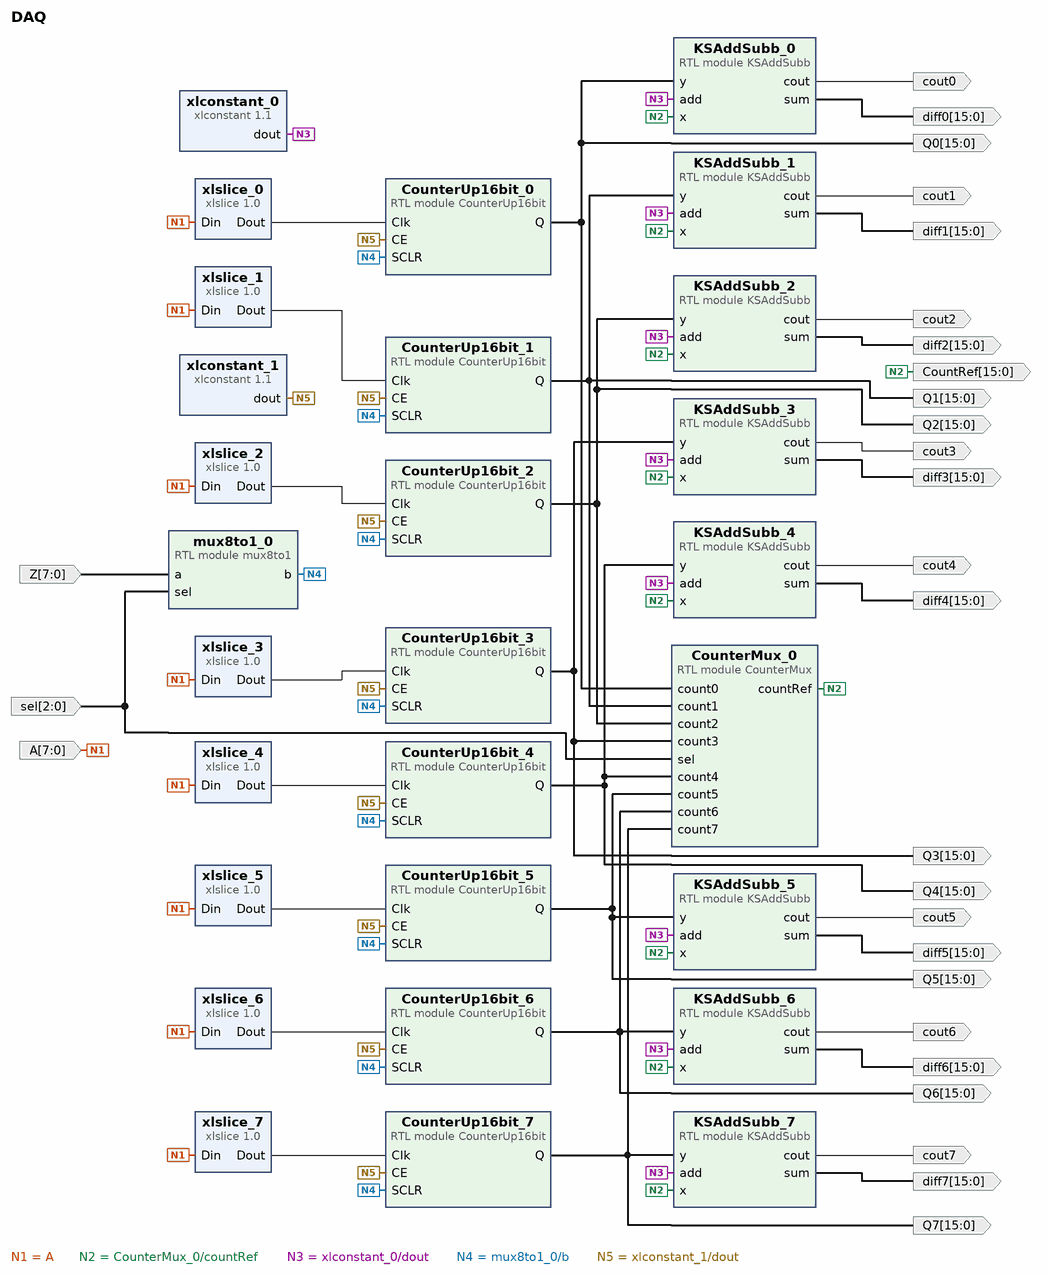
[diagram p0: block diagram of the top level]
# Vivado block design DAQ, xc7z020clg400-1, Vivado 2019.2
create_bd_design DAQ

create_bd_port -dir O -from 15 -to 0 -type data Q0
create_bd_port -dir O -from 15 -to 0 -type data Q1
create_bd_port -dir O -from 15 -to 0 -type data Q2
create_bd_port -dir O -from 15 -to 0 -type data Q3
create_bd_port -dir I -from 2 -to 0 -type data sel
create_bd_port -dir O -from 15 -to 0 -type data Q4
create_bd_port -dir O -from 15 -to 0 -type data Q5
create_bd_port -dir O -from 15 -to 0 -type data Q6
create_bd_port -dir O -from 15 -to 0 -type data Q7
create_bd_port -dir I -from 7 -to 0 -type rst Z
set_property -dict {CONFIG.POLARITY ACTIVE_HIGH} [get_bd_ports Z]
create_bd_port -dir O -from 15 -to 0 -type data CountRef
create_bd_port -dir O -from 15 -to 0 -type data diff0
create_bd_port -dir O -from 15 -to 0 -type data diff1
create_bd_port -dir O -from 15 -to 0 -type data diff2
create_bd_port -dir O -from 15 -to 0 -type data diff3
create_bd_port -dir O -from 15 -to 0 -type data diff4
create_bd_port -dir O -from 15 -to 0 -type data diff5
create_bd_port -dir O -from 15 -to 0 -type data diff6
create_bd_port -dir O -type data cout0
create_bd_port -dir O -type data cout1
create_bd_port -dir O -type data cout2
create_bd_port -dir O -type data cout3
create_bd_port -dir O -type data cout4
create_bd_port -dir O -type data cout5
create_bd_port -dir O -type data cout6
create_bd_port -dir O -type data cout7
create_bd_port -dir O -from 15 -to 0 -type data diff7
create_bd_port -dir I -from 7 -to 0 A

create_bd_cell -type ip -vlnv xilinx.com:ip:xlslice:1.0 xlslice_0
set_property -dict {CONFIG.DIN_WIDTH 8} [get_bd_cells xlslice_0]
create_bd_cell -type ip -vlnv xilinx.com:ip:xlslice:1.0 xlslice_4
set_property -dict {CONFIG.DIN_FROM 4 CONFIG.DIN_TO 4 CONFIG.DIN_WIDTH 8 CONFIG.DOUT_WIDTH 1} [get_bd_cells xlslice_4]
create_bd_cell -type ip -vlnv xilinx.com:ip:xlslice:1.0 xlslice_5
set_property -dict {CONFIG.DIN_FROM 5 CONFIG.DIN_TO 5 CONFIG.DIN_WIDTH 8 CONFIG.DOUT_WIDTH 1} [get_bd_cells xlslice_5]
create_bd_cell -type ip -vlnv xilinx.com:ip:xlslice:1.0 xlslice_6
set_property -dict {CONFIG.DIN_FROM 6 CONFIG.DIN_TO 6 CONFIG.DIN_WIDTH 8 CONFIG.DOUT_WIDTH 1} [get_bd_cells xlslice_6]
create_bd_cell -type ip -vlnv xilinx.com:ip:xlslice:1.0 xlslice_7
set_property -dict {CONFIG.DIN_FROM 7 CONFIG.DIN_TO 7 CONFIG.DIN_WIDTH 8 CONFIG.DOUT_WIDTH 1} [get_bd_cells xlslice_7]
create_bd_cell -type module -reference mux8to1 mux8to1_0
create_bd_cell -type module -reference CounterMux CounterMux_0
create_bd_cell -type ip -vlnv xilinx.com:ip:xlconstant:1.1 xlconstant_0
set_property -dict {CONFIG.CONST_VAL 0b1} [get_bd_cells xlconstant_0]
create_bd_cell -type module -reference KSAddSubb KSAddSubb_0
create_bd_cell -type module -reference KSAddSubb KSAddSubb_1
create_bd_cell -type module -reference KSAddSubb KSAddSubb_2
create_bd_cell -type module -reference KSAddSubb KSAddSubb_3
create_bd_cell -type module -reference KSAddSubb KSAddSubb_4
create_bd_cell -type module -reference KSAddSubb KSAddSubb_5
create_bd_cell -type module -reference KSAddSubb KSAddSubb_6
create_bd_cell -type module -reference KSAddSubb KSAddSubb_7
create_bd_cell -type ip -vlnv xilinx.com:ip:xlslice:1.0 xlslice_3
set_property -dict {CONFIG.DIN_FROM 3 CONFIG.DIN_TO 3 CONFIG.DIN_WIDTH 8 CONFIG.DOUT_WIDTH 1} [get_bd_cells xlslice_3]
create_bd_cell -type ip -vlnv xilinx.com:ip:xlslice:1.0 xlslice_2
set_property -dict {CONFIG.DIN_FROM 2 CONFIG.DIN_TO 2 CONFIG.DIN_WIDTH 8 CONFIG.DOUT_WIDTH 1} [get_bd_cells xlslice_2]
create_bd_cell -type ip -vlnv xilinx.com:ip:xlslice:1.0 xlslice_1
set_property -dict {CONFIG.DIN_FROM 1 CONFIG.DIN_TO 1 CONFIG.DIN_WIDTH 8 CONFIG.DOUT_WIDTH 1} [get_bd_cells xlslice_1]
create_bd_cell -type ip -vlnv xilinx.com:ip:xlconstant:1.1 xlconstant_1
set_property -dict {CONFIG.CONST_VAL 0b0} [get_bd_cells xlconstant_1]
create_bd_cell -type module -reference CounterUp16bit CounterUp16bit_0
create_bd_cell -type module -reference CounterUp16bit CounterUp16bit_1
create_bd_cell -type module -reference CounterUp16bit CounterUp16bit_2
create_bd_cell -type module -reference CounterUp16bit CounterUp16bit_3
create_bd_cell -type module -reference CounterUp16bit CounterUp16bit_4
create_bd_cell -type module -reference CounterUp16bit CounterUp16bit_5
create_bd_cell -type module -reference CounterUp16bit CounterUp16bit_6
create_bd_cell -type module -reference CounterUp16bit CounterUp16bit_7

# ---- connections ----

connect_bd_net -net clk_1 [get_bd_ports A] \
  [get_bd_pins xlslice_0/Din] [get_bd_pins xlslice_4/Din] [get_bd_pins xlslice_5/Din] [get_bd_pins xlslice_6/Din] \
  [get_bd_pins xlslice_7/Din] [get_bd_pins xlslice_3/Din] [get_bd_pins xlslice_2/Din] [get_bd_pins xlslice_1/Din]
connect_bd_net -net c_counter_binary_0_Q [get_bd_pins CounterUp16bit_0/Q] \
  [get_bd_ports Q0] [get_bd_pins KSAddSubb_0/y] [get_bd_pins CounterMux_0/count0]
connect_bd_net [get_bd_ports Z] [get_bd_pins mux8to1_0/a]
connect_bd_net [get_bd_pins CounterMux_0/countRef] \
  [get_bd_ports CountRef] [get_bd_pins KSAddSubb_4/x] [get_bd_pins KSAddSubb_3/x] [get_bd_pins KSAddSubb_2/x] \
  [get_bd_pins KSAddSubb_1/x] [get_bd_pins KSAddSubb_0/x] [get_bd_pins KSAddSubb_5/x] [get_bd_pins KSAddSubb_6/x] \
  [get_bd_pins KSAddSubb_7/x]
connect_bd_net [get_bd_ports sel] [get_bd_pins mux8to1_0/sel] [get_bd_pins CounterMux_0/sel]
connect_bd_net [get_bd_pins xlconstant_0/dout] \
  [get_bd_pins KSAddSubb_6/add] [get_bd_pins KSAddSubb_7/add] [get_bd_pins KSAddSubb_5/add] [get_bd_pins KSAddSubb_4/add] \
  [get_bd_pins KSAddSubb_3/add] [get_bd_pins KSAddSubb_2/add] [get_bd_pins KSAddSubb_1/add] [get_bd_pins KSAddSubb_0/add]
connect_bd_net [get_bd_pins KSAddSubb_0/sum] [get_bd_ports diff0]
connect_bd_net [get_bd_pins KSAddSubb_1/sum] [get_bd_ports diff1]
connect_bd_net [get_bd_pins KSAddSubb_2/sum] [get_bd_ports diff2]
connect_bd_net [get_bd_pins KSAddSubb_3/sum] [get_bd_ports diff3]
connect_bd_net [get_bd_pins KSAddSubb_4/sum] [get_bd_ports diff4]
connect_bd_net [get_bd_pins KSAddSubb_5/sum] [get_bd_ports diff5]
connect_bd_net [get_bd_pins KSAddSubb_0/cout] [get_bd_ports cout0]
connect_bd_net [get_bd_pins KSAddSubb_1/cout] [get_bd_ports cout1]
connect_bd_net [get_bd_pins KSAddSubb_2/cout] [get_bd_ports cout2]
connect_bd_net [get_bd_pins KSAddSubb_3/cout] [get_bd_ports cout3]
connect_bd_net [get_bd_pins KSAddSubb_4/cout] [get_bd_ports cout4]
connect_bd_net [get_bd_pins KSAddSubb_5/cout] [get_bd_ports cout5]
connect_bd_net [get_bd_pins KSAddSubb_7/cout] [get_bd_ports cout7]
connect_bd_net [get_bd_pins KSAddSubb_7/sum] [get_bd_ports diff7]
connect_bd_net [get_bd_pins KSAddSubb_6/sum] [get_bd_ports diff6]
connect_bd_net [get_bd_pins KSAddSubb_6/cout] [get_bd_ports cout6]
connect_bd_net [get_bd_pins xlslice_1/Dout] [get_bd_pins CounterUp16bit_1/Clk]
connect_bd_net [get_bd_pins CounterUp16bit_1/Q] [get_bd_pins KSAddSubb_1/y] [get_bd_ports Q1] [get_bd_pins CounterMux_0/count1]
connect_bd_net [get_bd_pins CounterUp16bit_2/Q] [get_bd_pins KSAddSubb_2/y] [get_bd_ports Q2] [get_bd_pins CounterMux_0/count2]
connect_bd_net [get_bd_pins CounterUp16bit_3/Q] [get_bd_pins KSAddSubb_3/y] [get_bd_ports Q3] [get_bd_pins CounterMux_0/count3]
connect_bd_net [get_bd_pins CounterUp16bit_4/Q] [get_bd_pins KSAddSubb_4/y] [get_bd_ports Q4] [get_bd_pins CounterMux_0/count4]
connect_bd_net [get_bd_pins CounterUp16bit_5/Q] [get_bd_ports Q5] [get_bd_pins KSAddSubb_5/y] [get_bd_pins CounterMux_0/count5]
connect_bd_net [get_bd_pins CounterUp16bit_6/Q] [get_bd_ports Q6] [get_bd_pins KSAddSubb_6/y] [get_bd_pins CounterMux_0/count6]
connect_bd_net [get_bd_pins CounterUp16bit_7/Q] [get_bd_pins KSAddSubb_7/y] [get_bd_ports Q7] [get_bd_pins CounterMux_0/count7]
connect_bd_net [get_bd_pins mux8to1_0/b] \
  [get_bd_pins CounterUp16bit_0/SCLR] [get_bd_pins CounterUp16bit_1/SCLR] [get_bd_pins CounterUp16bit_2/SCLR] \
  [get_bd_pins CounterUp16bit_3/SCLR] [get_bd_pins CounterUp16bit_4/SCLR] [get_bd_pins CounterUp16bit_5/SCLR] \
  [get_bd_pins CounterUp16bit_6/SCLR] [get_bd_pins CounterUp16bit_7/SCLR]
connect_bd_net [get_bd_pins xlslice_0/Dout] [get_bd_pins CounterUp16bit_0/Clk]
connect_bd_net [get_bd_pins xlslice_2/Dout] [get_bd_pins CounterUp16bit_2/Clk]
connect_bd_net [get_bd_pins xlslice_3/Dout] [get_bd_pins CounterUp16bit_3/Clk]
connect_bd_net [get_bd_pins xlslice_4/Dout] [get_bd_pins CounterUp16bit_4/Clk]
connect_bd_net [get_bd_pins xlslice_5/Dout] [get_bd_pins CounterUp16bit_5/Clk]
connect_bd_net [get_bd_pins xlslice_6/Dout] [get_bd_pins CounterUp16bit_6/Clk]
connect_bd_net [get_bd_pins xlslice_7/Dout] [get_bd_pins CounterUp16bit_7/Clk]
connect_bd_net [get_bd_pins xlconstant_1/dout] \
  [get_bd_pins CounterUp16bit_0/CE] [get_bd_pins CounterUp16bit_1/CE] [get_bd_pins CounterUp16bit_2/CE] \
  [get_bd_pins CounterUp16bit_3/CE] [get_bd_pins CounterUp16bit_4/CE] [get_bd_pins CounterUp16bit_5/CE] \
  [get_bd_pins CounterUp16bit_6/CE] [get_bd_pins CounterUp16bit_7/CE]

validate_bd_design
save_bd_design
